# Altium schematic sheet Buck Regulator Schematic.SchDoc
size A4; SheetNumber: 1; SheetTotal: 1
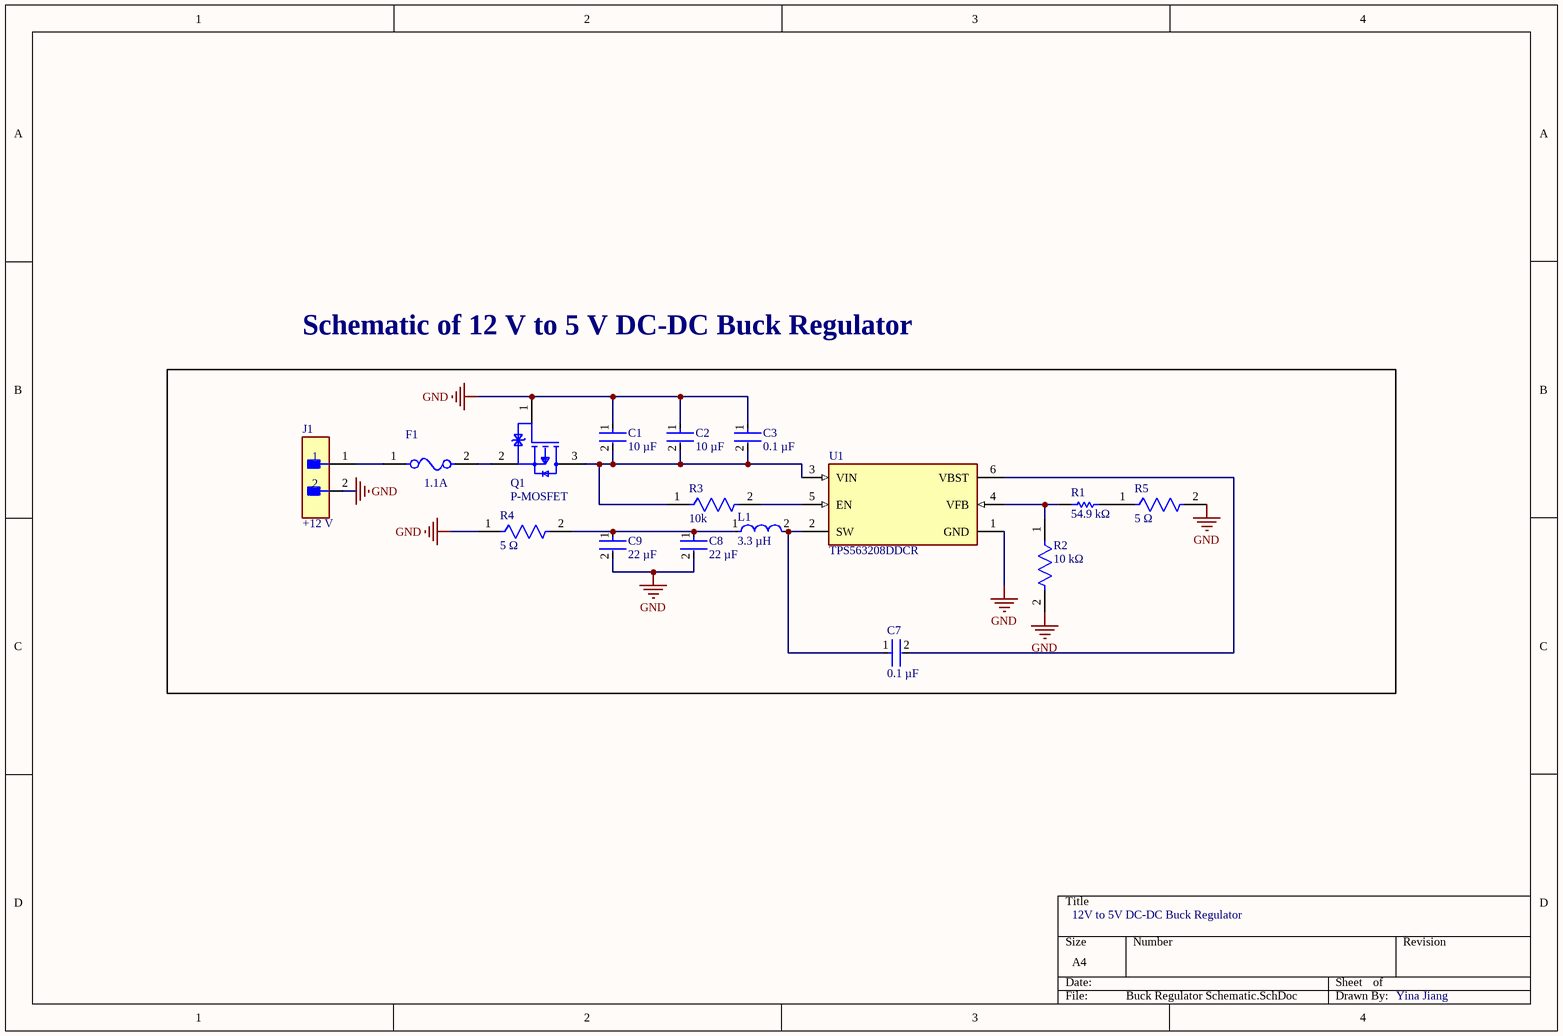
[diagram p0: Buck Regulator Schematic.SchDoc]

## Parts
C1  10 µF  [FP-CC0805-EB-IPC_C]
C2  10 µF  [FP-CC0805-EB-IPC_C]
C3  0.1 µF  [FP-AC0805-0_85-MFG]
C7  0.1 µF  [FP-AC0805-0_85-MFG]
C8  22 µF  [FP-GCM31C-0_2-e0_3_0_8-MFG]
C9  22 µF  [FP-GCM31C-0_2-e0_3_0_8-MFG]
F1  1.1A  [FP-MF-MSMF110-16-MFG]
J1  +12 V  [FP-1776508-MFG]
L1  3.3 µH  [FP-IHLP-2525CZ-FP_2_413x3-MFG]
Q1  P-MOSFET  [FP-SOT23-MFG]
R1  54.9 kΩ  [RESC2512(6432)_M]
R2  10 kΩ  [FP-AC0603-IPC_A]
R3  10k  [FP-AC0603-IPC_A]
R4  5 Ω  [FP-RLT1220-F-MFG]
R5  5 Ω  [FP-RLT1220-F-MFG]
U1  TPS563208DDCR  [FP-DDC0006A-MFG]

## Nets
GND: C1.1 C2.1 C3.1 C8.2 C9.2 J1.2 Q1.1(G) R2.2 R4.1 R5.2 U1.1(GND)
NetC1_2: C1.2 C2.2 C3.2 Q1.3(D) R3.1 U1.3(VIN)
NetC7_1: C7.1 L1.2 U1.2(SW)
NetC7_2: C7.2 U1.6(VBST)
NetC8_1: C8.1 C9.1 L1.1 R4.2
NetF1_1: F1.1 J1.1
NetF1_2: F1.2 Q1.2(S)
NetR1_1: R1.1 R2.1 U1.4(VFB)
NetR1_2: R1.2 R5.1
NetR3_2: R3.2 U1.5(EN)

## Notes on the sheet
- Schematic of 12 V to 5 V DC-DC Buck Regulator
- 12V to 5V DC-DC Buck Regulator
- Yina Jiang

## Library data of the parts
C1 C2 = CMP-03422-001511-1: CAP CER 10UF 10V X7R 0805; Tolerance: 10%; Dielectric: X7R; Series: CC; Min Operating Temperature: -55°C; Mount: Surface Mount; Radiation Hardening: No; Length: 2mm; Case/Package: 0805; Width: 0.049inch; Lead Free: Lead Free; Max Operating Temperature: 125°C; Thickness: 0.057inch; Capacitance: 10uF; Construction: Flat; Resistor Type: Ceramic; Height: 1.6mm; Halogen Free: Halogen Free; RoHS Compliant: Yes; Voltage Rating (DC): 10V; Case Code (Metric): 2012; Case Code (Imperial): 0805; Depth: 1.25mm; Voltage Rating: 10V; Packaging: Tape and Reel
C3 C7 = CMP-03422-000105-1: 0.10µF 50V Ceramic Capacitor X7R 0805 (2012 Metric) 0.079" L x 0.049" W (2.00mm x 1.25mm); Manufacturer Part Number: AC0805KRX7R9BB104; Manufacturer: Yageo; Tolerance: 0.1; Automotive Grade: Grade 1; Temperature Coefficient: 15%; Value: 100 nF; Device Class L2: Capacitors; Digikey Description: 0.10µF 50V Ceramic Capacitor X7R 0805 (2012 Metric) 0.079" L x 0.049" W (2.00mm x 1.25mm); Automotive: Yes; Device Class L1: Passive Components; Package: AC0805-0.85; Category: Cap; Footprint Url: http://www.yageo.com/exep/pages/download/literatures/UPY-C_GEN_24.pdf; RoHS: TRUE; Device Class L3: Ceramic Capacitors; Temperature: -55°C to +125°C; Octopart: https://octopart.com/ac0805krx7r9bb104-yageo-71334198; ComponentLink2URL: http://www.yageo.com/documents/recent/UPY-AC_NP0X7R_16V-to-630V_12.pdf; Voltage Rating: 50 V; Ipc Land Pattern Name: CAPC200125X85; Temperature Characteristic: X7R; Material: Ceramic; Temperature Range Low: -55°C; Lead Free: Yes; ComponentLink2Description: Datasheet; Height: 0.95mm; Capacitance: 100 nF; Temperature Range High: +125°C
C8 C9 = CMP-00260-135708682-1: GCM31CD70J226KE02K Multilayer Ceramic Capacitors MLCC - SMD/SMT 1206 6.3VDC 22 F 10 X7T AEC-Q200; Capacitance: 22µF; Tolerance: 10%; Voltage Rating: 6.3V; Lifecycle Status: Production; Height: 1.8mm; Min Operating Temperature: -55°C; NexarPartId: 135708682; Max Operating Temperature: 125°C; Case/Package: 1206; Material: Ceramic
F1 = CMP-07400-000018-1: PTC RESET FUSE 16V 1.1A 1812; Manufacturer Part Number: MF-MSMF110/16-2; Manufacturer: Bourns; Automotive Grade: Grade 3; Trip Current: 2.2A; Trip Time: 0.3s; Value: 0.04-0.21Ω; Current Rating: 100A; Category: Fuse; ComponentLink2Description: Datasheet; Temperature: -40°C to +85°C; Octopart: https://octopart.com/mf-msmf110%2F16-2-bourns-40767; Ambient Temperature Range Low: -40°C; Device Class L3: unset; RoHS: TRUE; Device Class L2: PTC Resettable Fuses; Package: MF-MSMF110/16; Digikey Description: PTC RESET FUSE 16V 1.1A 1812; Height: 0.85mm; Mouser Description: Resettable Fuses - PPTC 1.1A 16V 0.04ohm; Lead Free: Yes; Automotive: Yes; Hold Current: 1.1A; Resistance: 0.04-0.21Ω; Temperature Range Low: -40°C; Device Class L1: Circuit Protection; Ambient Temperature Range High: +85°C; Voltage Rating: 16V; ComponentLink2URL: https://upverter.com/datasheet/72639194a1e73201de7e7957ee4193eb5a54a50e.pdf; Temperature Range High: +85°C
J1 = CMP-09399-000017-1: TERM BLOCK HDR 2POS 90DEG 5.08MM; Connector Type: Plug; Number of Positions: 2; Voltage: 300V; Number of Levels: 1; Max Current Rating: 12A; Voltage Rating: 250V; Approvals: CSA; Pitch: 5.08mm; Package Quantity: 50; Contact Material: Tin; Orientation: Right Angle; Packaging: Bulk; Height: 12.1mm; Lead Free: Lead Free; Contact Plating: Tin; Mount: Through Hole; Series: MSTB; Current: 12A; Housing Material: Polybutylene; Color: Green; RoHS Compliant: Yes; Number of Poles: 2; Length: 20.32mm; Weight: 5.396916oz; Number of Rows: 1; Flammability Rating: UL94 V-0; Housing Color: Green; Width: 20.32mm; Current Rating: 12A; Termination: Solder; Number of Positions Per Level: 2; Depth: 12mm; Number of Contacts: 2
L1 = CMP-02424-000626-1: Tin / Lead Inductors, High Saturation Series 3.3uH 6A 30mΩ 20%
Q1 = CMP-12801-000029-1: MOSFET P-CH 20V 600MA SOT23-3; Manufacturer Part Number: DMP2004K-7; Manufacturer: Diodes Inc.; Max Junction Temp: +150°C; Turn On Delay Time: 8.5ns; Gate To Source Voltage: 8V; Input Capacitace At Vds: 175pF @ -16V; Rthja Max: 227°C/W; Drain To Source Resistance: 1.1Ω; Turn Off Delay Time: 20.2ns; Standoff Height: 0.013mm; Drain To Source Breakdown Voltage: -20V; Number Of P Channels: 1; Power Dissipation: 550mW; Pulse Drain Current: -1.9A; Depletion Mode: False; Max Forward Diode Voltage: -1.2V; Threshold Vgs Min: -0.5V; Threshold Vgs Max: -1V; Continuous Drain Current: -600mA; Height: 1.1mm; ComponentLink2Description: Datasheet; ComponentLink2URL: https://www.diodes.com/assets/Datasheets/ds30933.pdf; Package: SOT23; Footprint Url: https://www.diodes.com/assets/Package-Files/SOT23.pdf; Lead Free: Yes; Octopart: https://octopart.com/dmp2004k-7-diodes+inc.-7151877; Digikey Description: MOSFET P-CH 20V 600MA SOT23-3; Device Class L1: Discrete Semiconductors; Drain To Source Voltage: -20V; Mouser Description: MOSFET P-Channel; Number Of Channels: 1; Device Class L3: MOSFETs; Temperature: -55°C to +150°C; Category: Trans; Device Class L2: Transistors; Automotive: No; Temperature Range High: +150°C; RoHS: TRUE; Temperature Range Low: -55°C
R1 = CMP-1018-00707-1: 54K9 1W 1% 2512 (6432 Metric)  SMD; Case-Metric: 6432; Case-EIA: 2512; Value: 54900.00 Ohm; Technology: SMT; Tolerance: 1 %; Power: 1 W
R2 R3 = CMP-03412-040683-1: RES 10kΩ 5.00% 0.2W 0603
R4 R5 = CMP-89038-000005-1: RES SMD 5 OHM 1% 1/3W 0805
U1 = CMP-04918-000356-1: IC REG BUCK ADJ 3A TSOT23-6; Min Output Voltage: 768mV; Output Configuration: Positive; Max Output Voltage: 7V; Quiescent Current: 400uA; Max Input Voltage: 17V; Min Input Voltage: 4.5V; Synchronous Rectifier: Yes; Switching Frequency: 580kHz; Number of Outputs: 1; Output Type: Adjustable; Mount: Surface Mount; Case/Package: SOT-23-6; Min Operating Temperature: -40°C; Packaging: Tape and Reel; RoHS Compliant: Yes; Output Current: 3A; Lead Free: Lead Free; Max Operating Temperature: 125°C